# EAGLE design rgb-led-cc-driver-mk-5.0 (EAGLE 6.5.0)
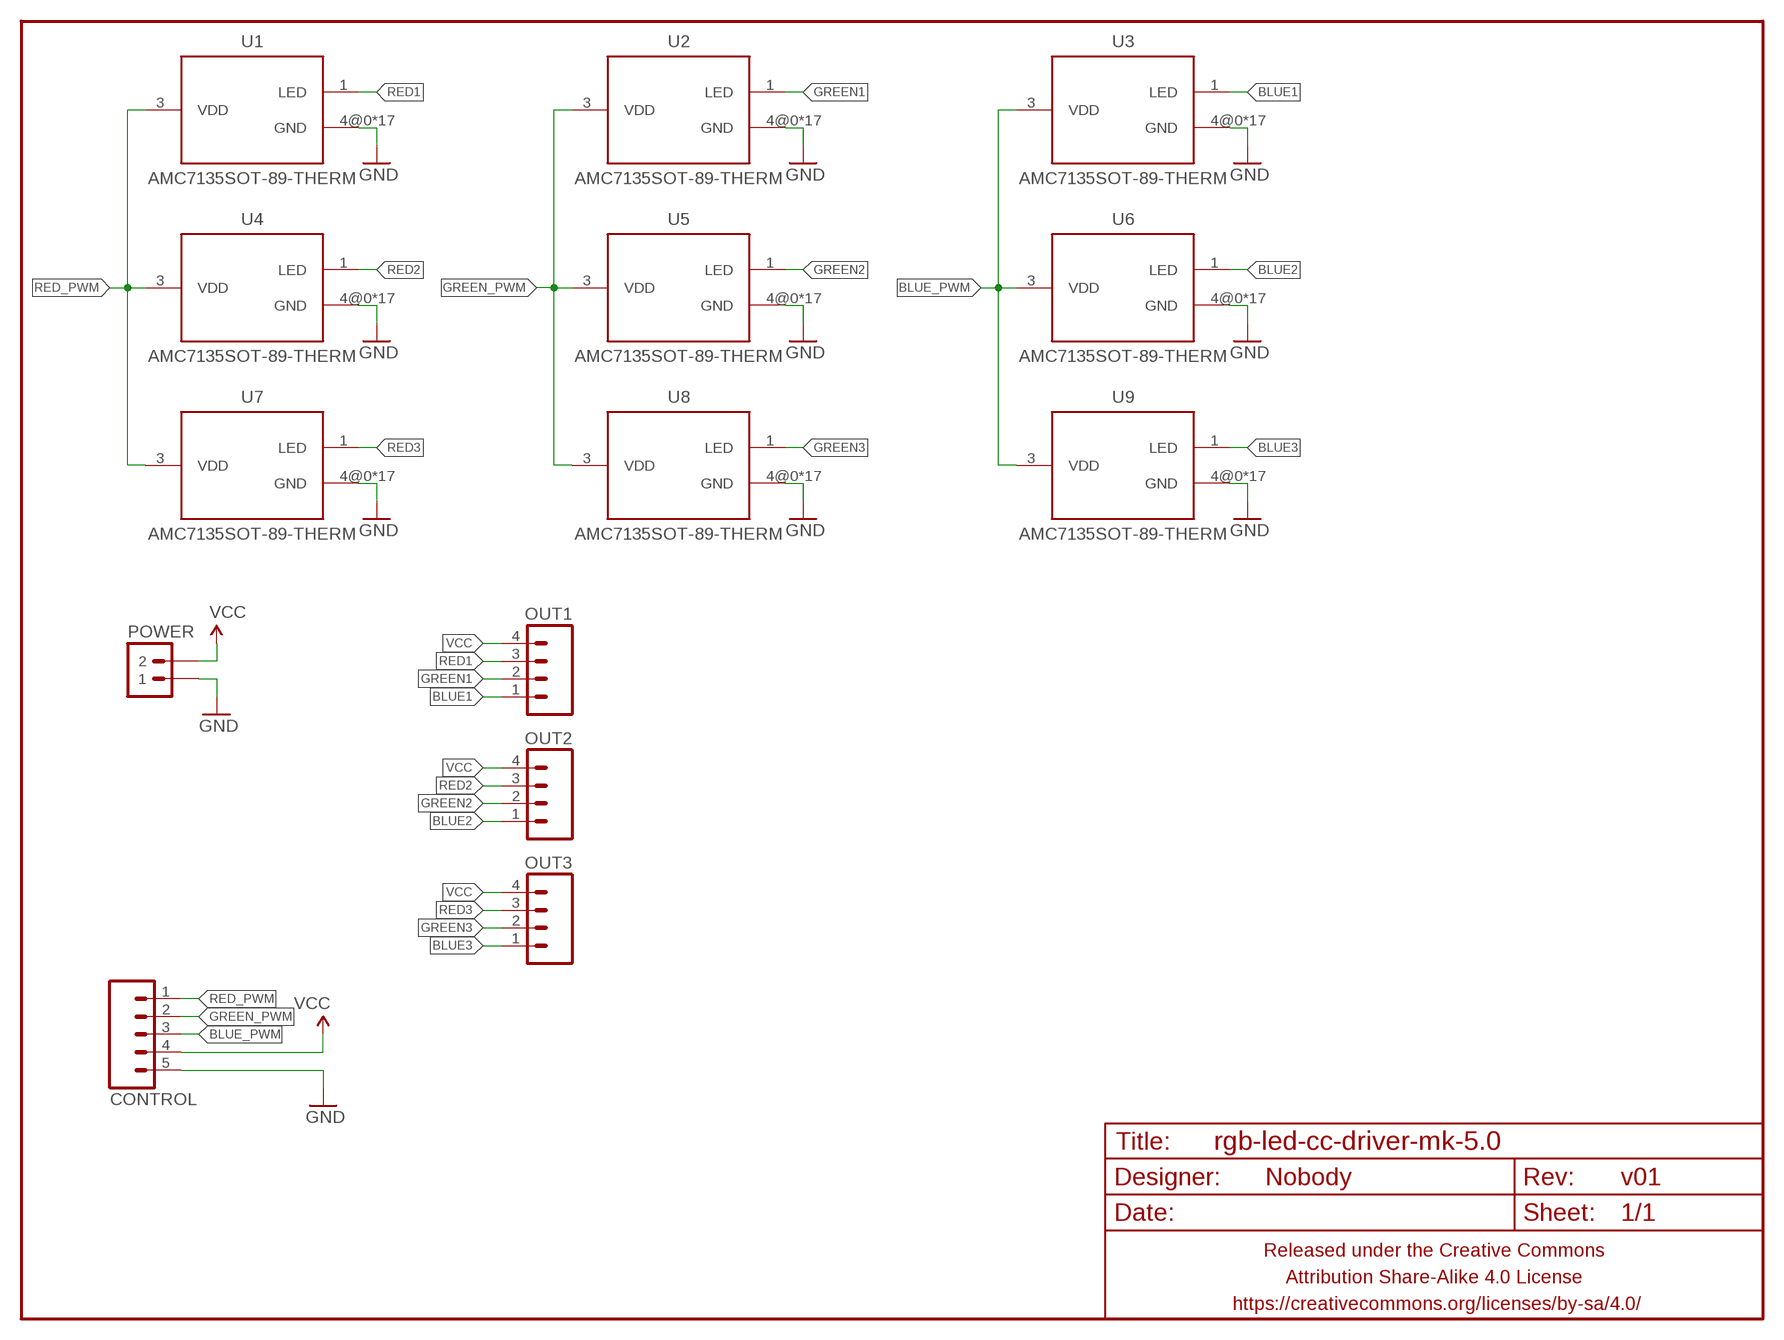
[diagram p0: schematic, sheet 1]

## Parts
CONTROL  M05JST-PH-RA-PTH  [JST-5-PH-RA-PTH]
FRAME1  FRAME-LETTERNO_PACKAGE  [DUMMY]
OUT1  M04JST-PTH  [JST-4-PH-RA-PTH]
OUT2  M04JST-PTH  [JST-4-PH-RA-PTH]
OUT3  M04JST-PTH  [JST-4-PH-RA-PTH]
POWER  M02PTH4  [1X02_XTRA_BIG]
U1  AMC7135SOT-89-THERM  [SOT89-THERM]
U2  AMC7135SOT-89-THERM  [SOT89-THERM]
U3  AMC7135SOT-89-THERM  [SOT89-THERM]
U4  AMC7135SOT-89-THERM  [SOT89-THERM]
U5  AMC7135SOT-89-THERM  [SOT89-THERM]
U6  AMC7135SOT-89-THERM  [SOT89-THERM]
U7  AMC7135SOT-89-THERM  [SOT89-THERM]
U8  AMC7135SOT-89-THERM  [SOT89-THERM]
U9  AMC7135SOT-89-THERM  [SOT89-THERM]

## Nets
BLUE1: OUT1.1 U3.1(LED)
BLUE2: OUT2.1 U6.1(LED)
BLUE3: OUT3.1 U9.1(LED)
BLUE_PWM: CONTROL.3 U3.3(VDD) U6.3(VDD) U9.3(VDD)
GND: CONTROL.5 POWER.1 U1.4@0(GND) U1.4@1(GND) U1.4@2(GND) U1.4@3(GND) U1.4@4(GND) U1.4@5(GND) U1.4@6(GND) U1.4@7(GND) U1.4@8(GND) U1.4@9(GND) U1.4@10(GND) U1.4@11(GND) U1.4@12(GND) U1.4@13(GND) U1.4@14(GND) U1.4@15(GND) U1.4@16(GND) U2.4@0(GND) U2.4@1(GND) U2.4@2(GND) U2.4@3(GND) U2.4@4(GND) U2.4@5(GND) U2.4@6(GND) U2.4@7(GND) U2.4@8(GND) U2.4@9(GND) U2.4@10(GND) U2.4@11(GND) U2.4@12(GND) U2.4@13(GND) U2.4@14(GND) U2.4@15(GND) U2.4@16(GND) U3.4@0(GND) U3.4@1(GND) U3.4@2(GND) U3.4@3(GND) U3.4@4(GND) U3.4@5(GND) U3.4@6(GND) U3.4@7(GND) U3.4@8(GND) U3.4@9(GND) U3.4@10(GND) U3.4@11(GND) U3.4@12(GND) U3.4@13(GND) U3.4@14(GND) U3.4@15(GND) U3.4@16(GND) U4.4@0(GND) U4.4@1(GND) U4.4@2(GND) U4.4@3(GND) U4.4@4(GND) U4.4@5(GND) U4.4@6(GND) U4.4@7(GND) U4.4@8(GND) U4.4@9(GND) U4.4@10(GND) U4.4@11(GND) U4.4@12(GND) U4.4@13(GND) U4.4@14(GND) U4.4@15(GND) U4.4@16(GND) U5.4@0(GND) U5.4@1(GND) U5.4@2(GND) U5.4@3(GND) U5.4@4(GND) U5.4@5(GND) U5.4@6(GND) U5.4@7(GND) U5.4@8(GND) U5.4@9(GND) U5.4@10(GND) U5.4@11(GND) U5.4@12(GND) U5.4@13(GND) U5.4@14(GND) U5.4@15(GND) U5.4@16(GND) U6.4@0(GND) U6.4@1(GND) U6.4@2(GND) U6.4@3(GND) U6.4@4(GND) U6.4@5(GND) U6.4@6(GND) U6.4@7(GND) U6.4@8(GND) U6.4@9(GND) U6.4@10(GND) U6.4@11(GND) U6.4@12(GND) U6.4@13(GND) U6.4@14(GND) U6.4@15(GND) U6.4@16(GND) U7.4@0(GND) U7.4@1(GND) U7.4@2(GND) U7.4@3(GND) U7.4@4(GND) U7.4@5(GND) U7.4@6(GND) U7.4@7(GND) U7.4@8(GND) U7.4@9(GND) U7.4@10(GND) U7.4@11(GND) U7.4@12(GND) U7.4@13(GND) U7.4@14(GND) U7.4@15(GND) U7.4@16(GND) U8.4@0(GND) U8.4@1(GND) U8.4@2(GND) U8.4@3(GND) U8.4@4(GND) U8.4@5(GND) U8.4@6(GND) U8.4@7(GND) U8.4@8(GND) U8.4@9(GND) U8.4@10(GND) U8.4@11(GND) U8.4@12(GND) U8.4@13(GND) U8.4@14(GND) U8.4@15(GND) U8.4@16(GND) U9.4@0(GND) U9.4@1(GND) U9.4@2(GND) U9.4@3(GND) U9.4@4(GND) U9.4@5(GND) U9.4@6(GND) U9.4@7(GND) U9.4@8(GND) U9.4@9(GND) U9.4@10(GND) U9.4@11(GND) U9.4@12(GND) U9.4@13(GND) U9.4@14(GND) U9.4@15(GND) U9.4@16(GND)
GREEN1: OUT1.2 U2.1(LED)
GREEN2: OUT2.2 U5.1(LED)
GREEN3: OUT3.2 U8.1(LED)
GREEN_PWM: CONTROL.2 U2.3(VDD) U5.3(VDD) U8.3(VDD)
RED1: OUT1.3 U1.1(LED)
RED2: OUT2.3 U4.1(LED)
RED3: OUT3.3 U7.1(LED)
RED_PWM: CONTROL.1 U1.3(VDD) U4.3(VDD) U7.3(VDD)
VCC: CONTROL.4 OUT1.4 OUT2.4 OUT3.4 POWER.2

## Library data of the parts
CONTROL = A_butts:M05: Header 5 Standard 5-pin 0.1" header. Use with straight break away headers (SKU : PRT-00116), right angle break away headers (PRT-00553), swiss pins (PRT-00743), machine pins (PRT-00117), and female headers (PRT-00115). Molex polarized connector foot print use with SKU : PRT-08230 with associated crimp pins and housings.
FRAME1 = A_butts:FRAME-LETTER: Schematic Frame Standard 8.5x11 US Letter frame; DESIGNER: Nobody; VERSION: v01
OUT1-OUT3 = A_butts:M04: Header 4 Standard 4-pin 0.1" header. Use with straight break away headers (SKU : PRT-00116), right angle break away headers (PRT-00553), swiss pins (PRT-00743), machine pins (PRT-00117), and female headers (PRT-00115). Molex polarized connector foot print use with SKU : PRT-08231 with associated crimp pins and housings. 1MM SMD Version SKU: PRT-10208; SKU: PRT-09916
POWER = A_butts:M02: Standard 2-pin 0.1" header. Use with - straight break away headers ( PRT-00116) - right angle break away headers (PRT-00553) - swiss pins (PRT-00743) - machine pins (PRT-00117) - female headers (PRT-00115) Molex polarized connector foot print use with: PRT-08233 with associated crimp pins and housings. 2.54_SCREWTERM for use with PRT-10571. 3.5mm Screw Terminal footprints for PRT-08084 5mm Screw Terminal footprints for use with PRT-08433
U1-U9 = A_butts:AMC7135

## Board
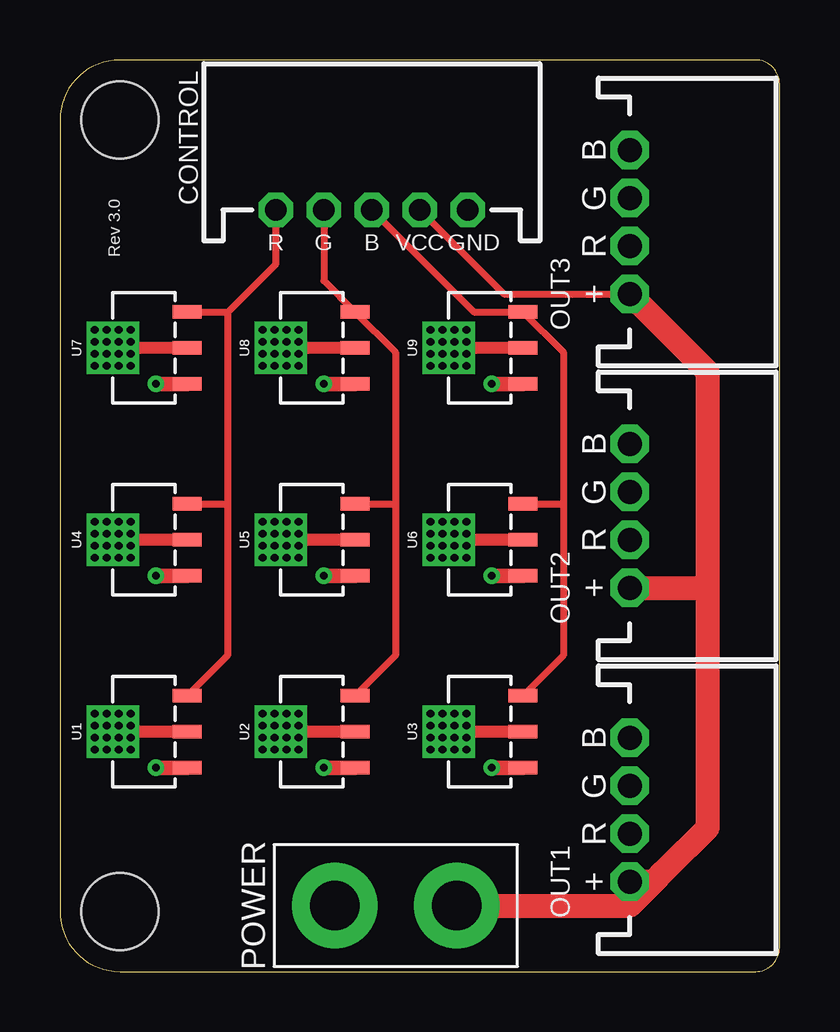
[diagram p1: board, top side]
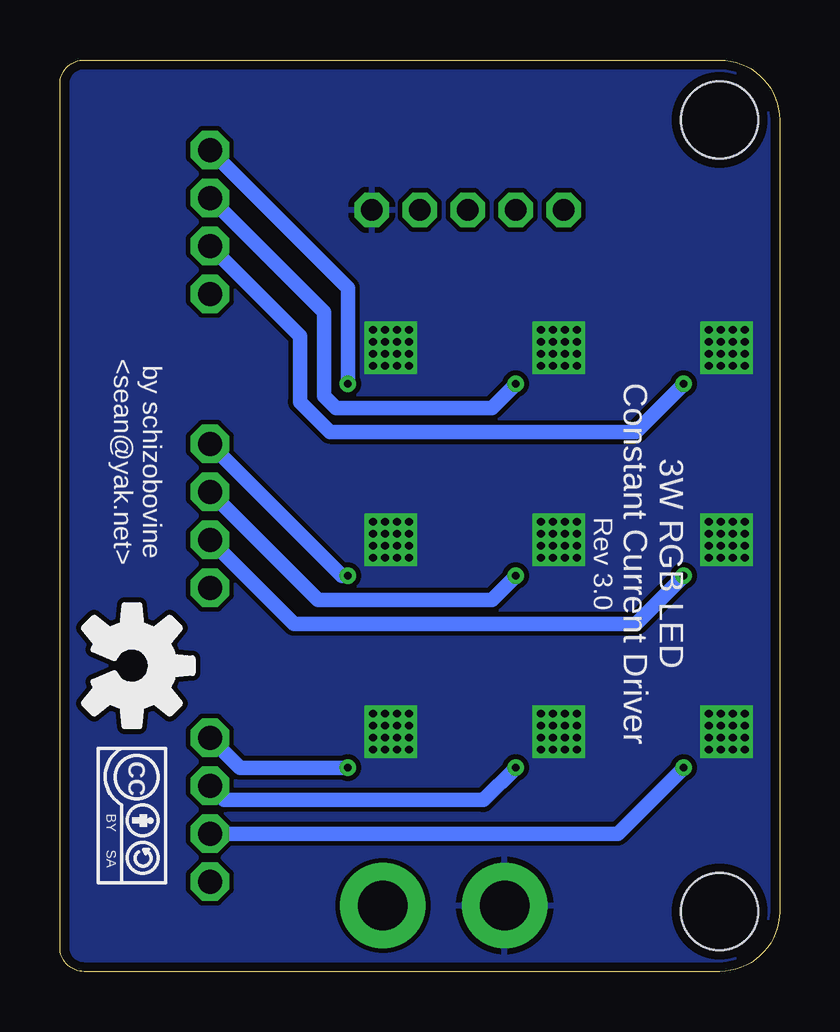
[diagram p2: board, bottom side, seen from below]

Size 30 x 38 mm. Coordinates in mm from the lower left corner, seen from the top.
Outline: 2.5,0 29,0 arc90 30,1 30,37 arc90 29,38 2.5,38 arc90 0,35.5 0,2.5 arc90 2.5,0
Copper layers (1*16): Top 0.0356mm / dielectric 1.5011mm / Bottom 0.0356mm
Design rules "LaenPCBOrder2": minimum track width 6mil, minimum drill 13mil, track to track 6mil, track to pad 6mil, pad to pad 6mil, via to via 6mil, smd to smd 6mil, copper to edge 15mil, drill to drill 6mil, minimum pad ring 7mil, minimum via ring 7mil, stop-mask expansion 3mil, vias tented up to drill 20mil, thermal gap 10mil
Holes 3.2 mm at 2.5,2.5 2.5,35.5

### Footprints (pad centres in the part's own frame; a part is rotated, then mirrored left to right if it is on the bottom)
JST-5-PH-RA-PTH = drill 0.9 pad 1.422 octagon: 1 -4,0; 2 -2,0; 3 0,0; 4 2,0; 5 4,0
JST-4-PH-RA-PTH = drill 1 pad 1.6 octagon: 1 0,0; 2 2,0; 3 4,0; 4 6,0
1X02_XTRA_BIG = drill 2.057 pad 3.556: 1 -2.54,0; 2 2.54,0
SOT89-THERM = smd 0.58 x 1.2: 1 -1.5,-1.8; 3 1.5,-1.8; 4@0 0,-1.8 | drill 0.33 pad 0.6 square: 4@1 -0.75,2.05; 4@2 -0.25,2.05; 4@3 0.25,2.05; 4@4 0.75,2.05; 4@5 -0.75,1.55; 4@6 -0.25,1.55; 4@7 0.25,1.55; 4@8 0.75,1.55; 4@9 -0.75,1.05; 4@10 -0.25,1.05; 4@11 0.25,1.05; 4@12 0.75,1.05; 4@13 -0.75,0.55; 4@14 -0.25,0.55; 4@15 0.25,0.55; 4@16 0.75,0.55

### Placement (x,y rotation side)
CONTROL  13,31.75 0 top
FRAME1  0,0 0 top
OUT1  23.75,9.75 270 top
OUT2  23.75,22 270 top
OUT3  23.75,34.25 270 top
POWER  14,2.75 0 top
U1  3.5,10 90 top
U2  10.5,10 90 top
U3  17.5,10 90 top
U4  3.5,18 90 top
U5  10.5,18 90 top
U6  17.5,18 90 top
U7  3.5,26 90 top
U8  10.5,26 90 top
U9  17.5,26 90 top
U$1  [CC-BY-SA-4.0-NO-URL]  27,6.5 270 bottom
U$3  [OSHWLOGO_BOT_0.2_A]  27,12.75 90 top

### Tracks (layer width: path | path; a pad name or v marks a point on that pad's centre or on a via)
BLUE1  (via drill 0.33)
  Top 0.6: U3.1 v18,8.5
  Bottom 0.6: v18,8.5 22.5,8.5 OUT1.1
BLUE2  (via drill 0.33)
  Top 0.6: U6.1 v18,16.5
  Bottom 0.6: v18,16.5 18.25,16.5 OUT2.1
BLUE3  (via drill 0.33)
  Top 0.6: U9.1 v18,24.5
  Bottom 0.6: v18,24.5 18,28.5 OUT3.1
BLUE_PWM
  Top 0.3: U3.3 21,13.2 21,19.5 | U6.3 21,19.5 | CONTROL.3 17.25,27.5 U9.3 21,25.8 21,19.5
GND
  Top 0.5: U7.4@0 3.2,26 U7.4@14 | U8.4@0 10.2,26 U8.4@14 | U9.4@0 17.2,26 U9.4@14 | U5.4@0 10.2,18 U5.4@14 | U4.4@0 3.2,18 U4.4@14 | U6.4@0 17.2,18 U6.4@14 | U3.4@0 17.2,10 U3.4@14 | U2.4@0 10.2,10 U2.4@14 | U1.4@0 3.2,10 U1.4@14
  pour Bottom (isolate 0.2): 2.5,0 29,0 arc90 30,1 30,37 arc90 29,38 2.5,38 arc90 0,35.5 0,2.5 arc90
GREEN1  (via drill 0.33)
  Top 0.6: U2.1 v11,8.5
  Bottom 0.6: v11,8.5 12.35,7.15 23.15,7.15 OUT1.2
GREEN2  (via drill 0.33)
  Top 0.6: U5.1 v11,16.5
  Bottom 0.6: v11,16.5 12,15.5 19.25,15.5 OUT2.2
GREEN3  (via drill 0.33)
  Top 0.6: U8.1 v11,24.5
  Bottom 0.6: OUT3.2 19,27.5 19,24 18.5,23.5 12,23.5 v11,24.5
GREEN_PWM
  Top 0.3: U2.3 14,13.2 14,19.5 | 14,19.5 14,25.8 U8.3 11,28.8 CONTROL.2 | U5.3 14,19.5
RED1  (via drill 0.33)
  Top 0.6: U1.1 v4,8.5
  Bottom 0.6: v4,8.5 6.75,5.75 OUT1.3
RED2  (via drill 0.33)
  Top 0.6: U4.1 v4,16.5
  Bottom 0.6: v4,16.5 6,14.5 20.25,14.5 OUT2.3
RED3  (via drill 0.33)
  Top 0.6: U7.1 v4,24.5
  Bottom 0.6: OUT3.3 20,26.5 20,23.75 18.75,22.5 6,22.5 v4,24.5
RED_PWM
  Top 0.3: U1.3 7,13.2 7,19.5 | 7,19.5 7,27.5 | U4.3 7,19.5 | U7.3 7,27.5 | 7,27.5 9,29.5 CONTROL.1
VCC
  Top 0.3: CONTROL.4 18.5,28.25 OUT3.4
  Top 1: 27,16 27,6 25.2,4.2 24.75,3.75 | 27,16 27,25 OUT3.4 | OUT2.4 27,16 | 24.75,3.75 OUT1.4 | POWER.2 23.75,2.75 24.75,3.75

### Text on the board
bPlace: by schizobovine / <sean@yak.net> | 3W RGB LED / Constant Current Driver
tNames: B | G | R | G | B | VCC | GND | R | + | B | G | R | + | B | G | R | +